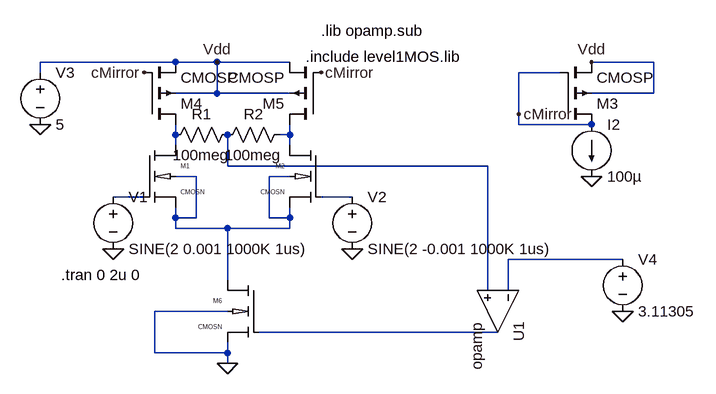
[diagram p0: schematic singleOMP.asc]
singleOMP.asc, the LTspice schematic file:
Version 4
SHEET 1 944 680
WIRE 160 16 -48 16
WIRE 224 16 160 16
WIRE 336 16 224 16
WIRE 896 16 800 16
WIRE -48 32 -48 16
WIRE 752 32 688 32
WIRE 224 64 224 16
WIRE 224 64 160 64
WIRE 336 64 224 64
WIRE 896 64 896 16
WIRE 896 64 800 64
WIRE 688 96 688 32
WIRE 688 112 688 96
WIRE 800 112 688 112
WIRE 160 128 160 112
WIRE 336 128 336 112
WIRE 336 128 320 128
WIRE 160 144 160 128
WIRE 336 144 336 128
WIRE 240 176 240 128
WIRE 640 176 240 176
WIRE 192 192 160 192
WIRE 336 192 304 192
WIRE 112 224 64 224
WIRE 432 224 384 224
WIRE 160 256 160 240
WIRE 192 256 192 192
WIRE 192 256 160 256
WIRE 304 256 304 192
WIRE 336 256 336 240
WIRE 336 256 304 256
WIRE 160 272 160 256
WIRE 240 272 160 272
WIRE 336 272 336 256
WIRE 336 272 240 272
WIRE 848 320 672 320
WIRE 240 352 240 272
WIRE 640 368 640 176
WIRE 672 368 672 320
WIRE 240 400 128 400
WIRE 656 432 288 432
WIRE 128 464 128 400
WIRE 240 464 240 448
WIRE 240 464 128 464
WIRE 240 480 240 464
FLAG 64 304 0
FLAG 432 304 0
FLAG -48 112 0
FLAG 112 32 cMirror
FLAG 384 32 cMirror
FLAG 224 16 Vdd
FLAG 800 16 Vdd
FLAG 800 192 0
FLAG 688 96 cMirror
FLAG 240 480 0
FLAG 848 400 0
SYMBOL cmosn 112 144 R0
SYMATTR InstName M1
SYMATTR Value2 l=0.36u w=0.72u
SYMBOL cmosn 384 144 M0
SYMATTR InstName M2
SYMATTR Value2 l=0.36u w=0.72u
SYMBOL voltage 64 208 R0
WINDOW 123 24 116 Left 2
WINDOW 39 0 0 Left 2
SYMATTR InstName V1
SYMATTR Value SINE(2 0.001 1000K 1us)
SYMBOL voltage 432 208 R0
WINDOW 123 24 116 Left 2
WINDOW 39 0 0 Left 2
SYMATTR InstName V2
SYMATTR Value SINE(2 -0.001 1000K 1us)
SYMBOL voltage -48 16 R0
WINDOW 123 0 0 Left 2
WINDOW 39 0 0 Left 2
SYMATTR InstName V3
SYMATTR Value 5
SYMBOL cmosp 112 112 M180
SYMATTR InstName M4
SYMATTR Value2 l=0.36u w=0.36u
SYMBOL cmosp 384 112 R180
SYMATTR InstName M5
SYMATTR Value2 l=0.36u w=0.36u
SYMBOL cmosp 752 112 M180
SYMATTR InstName M3
SYMATTR Value2 l=0.36u w=0.36u
SYMBOL current 800 112 R0
WINDOW 123 0 0 Left 2
WINDOW 39 0 0 Left 2
SYMATTR InstName I2
SYMATTR Value 100µ
SYMBOL cmosn 288 352 M0
SYMATTR InstName M6
SYMATTR Value2 l=0.36u w=3.6u
SYMBOL Opamps\\opamp 720 400 R90
SYMATTR InstName U1
SYMBOL voltage 848 304 R0
WINDOW 123 0 0 Left 2
WINDOW 39 0 0 Left 2
SYMATTR InstName V4
SYMATTR Value 3.11305
SYMBOL res 256 112 R90
WINDOW 0 0 56 VBottom 2
WINDOW 3 32 56 VTop 2
SYMATTR InstName R1
SYMATTR Value 100meg
SYMBOL res 336 112 R90
WINDOW 0 0 56 VBottom 2
WINDOW 3 32 56 VTop 2
SYMATTR InstName R2
SYMATTR Value 100meg
TEXT 360 8 Left 2 !.include level1MOS.lib
TEXT -16 344 Left 2 !.tran 0 2u 0
TEXT 384 -32 Left 2 !.lib opamp.sub

The netlist it stands for:
* singleOMP.asc
M1 N001 N005 N004 N004 CMOSN l=0.36u w=0.72u
M2 N002 N006 N004 N004 CMOSN l=0.36u w=0.72u
V1 N005 0 SINE(2 0.001 1000K 1us)
V2 N006 0 SINE(2 -0.001 1000K 1us)
V3 Vdd 0 5
M4 N001 cMirror Vdd Vdd CMOSP l=0.36u w=0.36u
M5 N002 cMirror Vdd Vdd CMOSP l=0.36u w=0.36u
M3 cMirror cMirror Vdd Vdd CMOSP l=0.36u w=0.36u
I2 cMirror 0 100µ
M6 N004 N008 0 0 CMOSN l=0.36u w=3.6u
XU1 N007 N003 N008 opamp Aol=100K GBW=10Meg  ; pins invin noninvin out
V4 N007 0 3.11305
R1 N003 N001 100meg
R2 N002 N003 100meg
.model NMOS NMOS
.model PMOS PMOS
.lib standard.mos
.include level1MOS.lib
.tran 0 2u 0
.lib opamp.sub
.lib tsmc018.lib
.backanno
.end